# Altium schematic sheet clever_watch.SchDoc: Clever watch
size A3; Date: 13/04/2022; CheckedBy: Karol Witusik; Author: Wiktor Lechowicz; DocumentNumber: 305113, 305087; Revision: 1.0; SheetNumber: 1; SheetTotal: 1
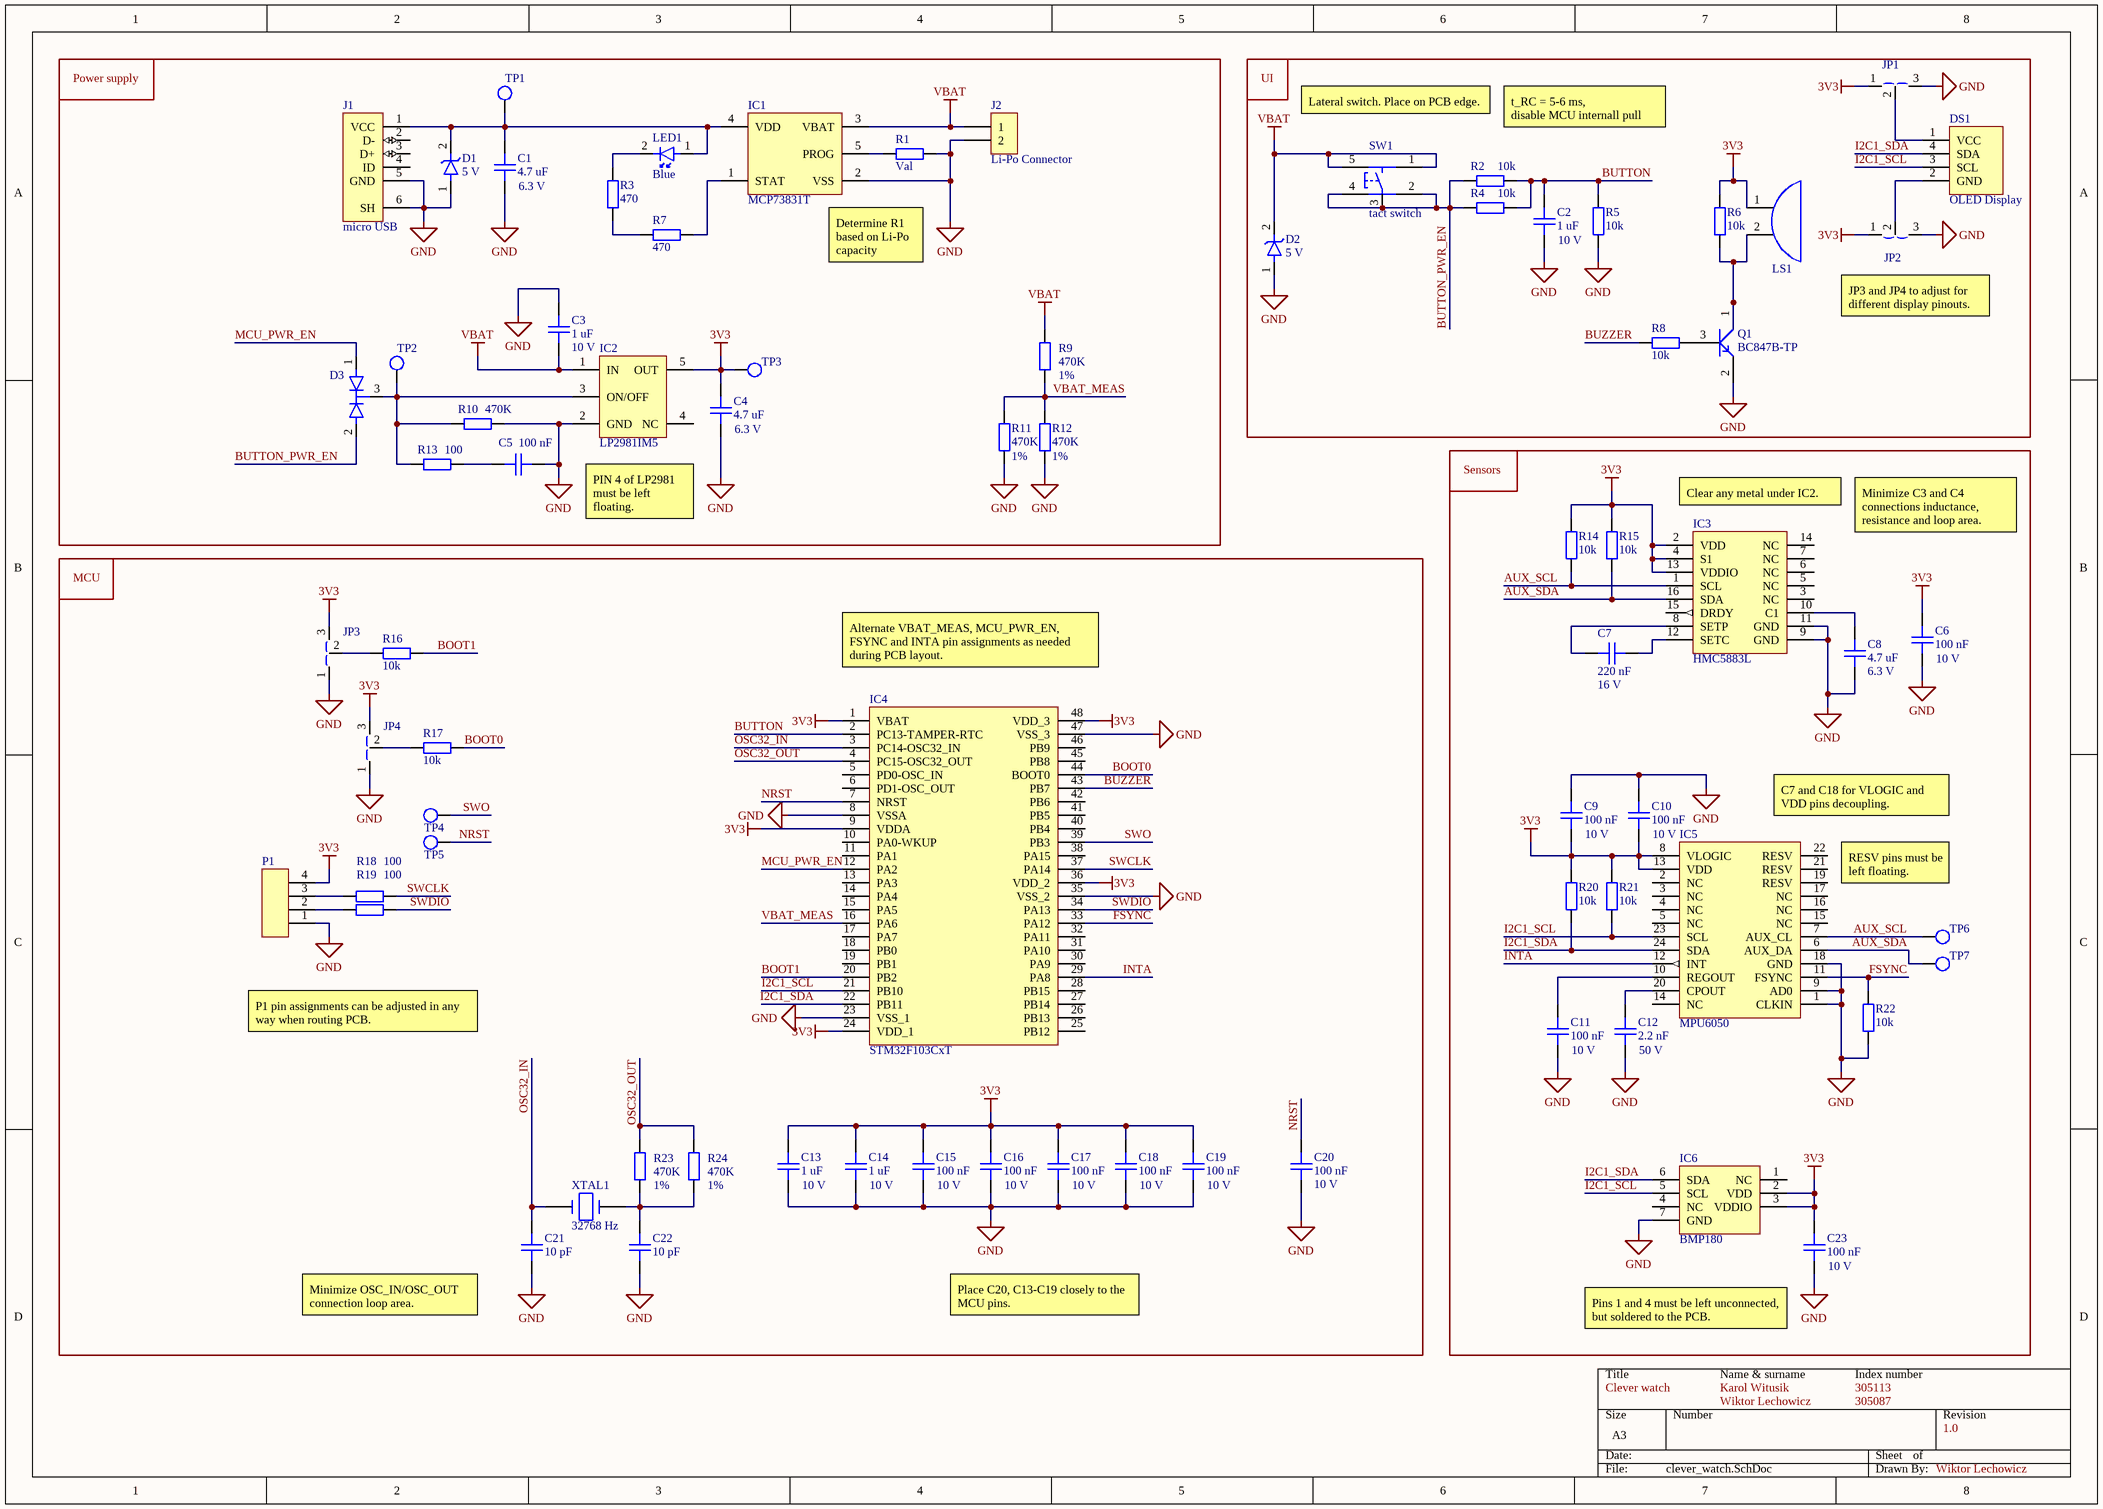
[diagram p0: clever_watch.SchDoc]

## Parts
C1  4.7 uF  Rated voltage: 6.3 V  [C0402]
C2  1 uF  Rated voltage: 10 V  [C0402]
C3  1 uF  Rated voltage: 10 V  [C0402]
C4  4.7 uF  Rated voltage: 6.3 V  [C0402]
C5  100 nF  [C0402]
C6  100 nF  Rated voltage: 10 V  [C0402]
C7  220 nF  Rated voltage: 16 V  [C0402]
C8  4.7 uF  Rated voltage: 6.3 V  [C0603]
C9  100 nF  Rated voltage: 10 V  [C0402]
C10  100 nF  Rated voltage: 10 V  [C0402]
C11  100 nF  Rated voltage: 10 V  [C0402]
C12  2.2 nF  Rated voltage: 50 V  [C0402]
C13  1 uF  Rated voltage: 10 V  [C0402]
C14  1 uF  Rated voltage: 10 V  [C0402]
C15  100 nF  Rated voltage: 10 V  [C0402]
C16  100 nF  Rated voltage: 10 V  [C0402]
C17  100 nF  Rated voltage: 10 V  [C0402]
C18  100 nF  Rated voltage: 10 V  [C0402]
C19  100 nF  Rated voltage: 10 V  [C0402]
C20  100 nF  Rated voltage: 10 V  [C0402]
C21  10 pF  [C0402]
C22  10 pF  [C0402]
C23  100 nF  Rated voltage: 10 V  [C0402]
D1  5 V  [SOD-323FL_477AB_ONS]
D2  5 V  [SOD-323FL_477AB_ONS]
D3  D_DOUBLE_CK2  [SOT65P210X110-3N]  (value not drawn)
DS1  OLED Display  [OLED SSD1306]
IC1  MCP73831T  [SOT-23-5_MC_MCH]
IC2  LP2981IM5  [SOT-23-5_MC_MCH]
IC3  HMC5883L  [LPCC16_HNW]
IC4  STM32F103CxT  [LQFP48-7x7mm]
IC5  MPU6050  [QFN24_4X4X0P9_IVS]
IC6  BMP180  [BMP180]
J1  micro USB  [AMPHENOL_10118194-0001LF]
J2  Li-Po Connector  [battery connector]  (no BOM)
JP1  JUMPER_3_PADS  [0402 jumper x3]  (value not drawn)
JP2  JUMPER_3_PADS  [0402 jumper x3]  (value not drawn)
JP3  JUMPER_3_PADS  [0402 jumper x3]  (value not drawn)
JP4  JUMPER_3_PADS  [0402 jumper x3]  (value not drawn)
LED1  Blue  [LED_0603]
LS1  BUZZER  [HDR_1X2_MALE]  (value not drawn)
P1  1x4 Header  [CONN_15-91-2045_MOL]  (value not drawn)
Q1  MPN: BC847B-TP  [SOT-23]  (hidden comment: Q_NPN_BEC)
R1  Val  [R0402]
R2  10k  [R0402]
R3  470  [R0402]
R4  10k  [R0402]
R5  10k  [R0402]
R6  10k  [R0402]
R7  470  [R0402]
R8  10k  [R0402]
R9  470K  Tolerance: 1%  [R0402]
R10  470K  [R0402]
R11  470K  Tolerance: 1%  [R0402]
R12  470K  Tolerance: 1%  [R0402]
R13  100  [R0402]
R14  10k  [R0402]
R15  10k  [R0402]
R16  10k  [R0402]
R17  10k  [R0402]
R18  100  [R0402]
R19  100  [R0402]
R20  10k  [R0402]
R21  10k  [R0402]
R22  10k  [R0402]
R23  470K  Tolerance: 1%  [R0402]
R24  470K  Tolerance: 1%  [R0402]
SW1  tact switch  [KMS221GLFS]
TP1  TEST_POINT  [Testpoint]  (value not drawn)  (no BOM)
TP2  TEST_POINT  [Testpoint]  (value not drawn)  (no BOM)
TP3  TEST_POINT  [Testpoint]  (value not drawn)  (no BOM)
TP4  TEST_POINT  [Testpoint]  (value not drawn)  (no BOM)
TP5  TEST_POINT  [Testpoint]  (value not drawn)  (no BOM)
TP6  TEST_POINT  [Testpoint]  (value not drawn)  (no BOM)
TP7  TEST_POINT  [Testpoint]  (value not drawn)  (no BOM)
XTAL1  32768 Hz  [ABS0732768KHZ7T]

## Blocks framed on the sheet
Power supply: C1 C3-C5 D1 D3 IC1 IC2 J1 J2 LED1 R1 R3 R7 R9-R13 TP1-TP3
UI: C2 D2 DS1 JP1 JP2 LS1 Q1 R2 R4-R6 R8 SW1
Sensors: C6-C12 C23 IC3 IC5 IC6 R14 R15 R20-R22 TP6 TP7
MCU: C13-C22 IC4 JP3 JP4 P1 R16-R19 R23 R24 TP4 TP5 XTAL1

## Nets
3V3: C4.2 C6.2 C9.1 C10.1 C13.2 C14.2 C15.2 C16.2 C17.2 C18.2 C19.2 C23.2 IC2.5(OUT) IC3.2(VDD) IC3.4(S1) IC3.13(VDDIO) IC4.1(VBAT) IC4.9(VDDA) IC4.24(VDD_1) IC4.36(VDD_2) IC4.48(VDD_3) IC5.8(VLOGIC) IC5.13(VDD) IC6.2(VDD) IC6.3(VDDIO) JP1.1 JP2.1 JP3.3 JP4.3 LS1.1 P1.4 R6.2 R14.2 R15.2 R20.2 R21.2 TP3.1
GND: C1.1 C2.1 C3.1 C4.1 C5.1 C6.1 C8.1 C9.2 C10.2 C11.1 C12.1 C13.1 C14.1 C15.1 C16.1 C17.1 C18.1 C19.1 C20.1 C21.2 C22.2 C23.1 D1.1(A) D2.1(A) IC1.2(VSS) IC2.2(GND) IC3.9(GND) IC3.11(GND) IC4.8(VSSA) IC4.23(VSS_1) IC4.35(VSS_2) IC4.47(VSS_3) IC5.1(CLKIN) IC5.9(AD0) IC5.18(GND) IC6.7(GND) J1.5(GND) J1.6(SH) J2.2 JP1.3 JP2.3 JP3.1 JP4.1 P1.1 Q1.2(E) R1.1 R5.2 R10.2 R11.1 R12.1 R22.1
VBAT: C3.2 D2.2(K) IC1.3(VBAT) IC2.1(IN) J2.1 R9.1 SW1.1 SW1.5
AUX_SCL: IC3.1(SCL) IC5.7(AUX_CL) R14.1 TP6.1
AUX_SDA: IC3.16(SDA) IC5.6(AUX_DA) R15.1 TP7.1
BOOT0: IC4.44(BOOT0) R17.2
BOOT1: IC4.20(PB2) R16.2
BUTTON: C2.2 IC4.2(PC13-TAMPER-RTC) R2.1 R4.1 R5.1
BUTTON_PWR_EN: D3.2(A2) R2.2 R4.2 SW1.2 SW1.3 SW1.4
BUZZER: IC4.43(PB7) R8.1
FSYNC: IC4.33(PA12) IC5.11(FSYNC) R22.2
I2C1_SCL: DS1.3(SCL) IC4.21(PB10) IC5.23(SCL) IC6.5(SCL) R21.1
I2C1_SDA: DS1.4(SDA) IC4.22(PB11) IC5.24(SDA) IC6.6(SDA) R20.1
INTA: IC4.29(PA8) IC5.12(INT)
MCU_PWR_EN: D3.1(A1) IC4.12(PA2)
NRST: C20.2 IC4.7(NRST) TP5.1
OSC32_IN: C21.1 IC4.3(PC14-OSC32_IN) XTAL1.1
OSC32_OUT: IC4.4(PC15-OSC32_OUT) R23.1 R24.1
SWCLK: IC4.37(PA14) R18.2
SWDIO: IC4.34(PA13) R19.2
SWO: IC4.39(PB3) TP4.1
VBAT_MEAS: IC4.16(PA6) R9.2 R11.2 R12.2
NetC1_2: C1.2 D1.2(K) IC1.4(VDD) J1.1(VCC) LED1.1(Anode) TP1.1
NetC5_2: C5.2 R13.2
NetC7_1: C7.1 IC3.12(SETC)
NetC7_2: C7.2 IC3.8(SETP)
NetC8_2: C8.2 IC3.10(C1)
NetC11_2: C11.2 IC5.10(REGOUT)
NetC12_2: C12.2 IC5.20(CPOUT)
NetC22_1: C22.1 R23.2 R24.2 XTAL1.2
NetD3_3: D3.3(K) IC2.3(ON/OFF) R10.1 R13.1 TP2.1
NetDS1_1: DS1.1(VCC) JP1.2
NetDS1_2: DS1.2(GND) JP2.2
NetIC1_1: IC1.1(STAT) R7.1
NetIC1_5: IC1.5(PROG) R1.2
NetJP3_2: JP3.2 R16.1
NetJP4_2: JP4.2 R17.1
NetLED1_2: LED1.2(Cathode) R3.2
NetLS1_2: LS1.2 Q1.1(C) R6.1
NetP1_2: P1.2 R19.1
NetP1_3: P1.3 R18.1
NetQ1_3: Q1.3(B) R8.2
NetR3_1: R3.1 R7.2

Not connected (* = marked no-connect by the designer): IC2 4(NC); IC3 3(NC) 5(NC) 6(NC) 7(NC) 14(NC) 15(DRDY); IC4 5(PD0-OSC_IN) 6(PD1-OSC_OUT) 10(PA0-WKUP) 11(PA1) 13(PA3) 14(PA4) 15(PA5) 17(PA7) 18(PB0) 19(PB1) 25(PB12) 26(PB13) 27(PB14) 28(PB15) 30(PA9) 31(PA10) 32(PA11) 38(PA15) 40(PB4) 41(PB5) 42(PB6) 45(PB8) 46(PB9); IC5 2(NC) 3(NC) 4(NC) 5(NC) 14(NC) 15(NC) 16(NC) 17(NC) 19(RESV) 21(RESV) 22(RESV); IC6 1(NC) 4(NC); J1 2(D-) 3(D+) 4(ID)

## Notes on the sheet
- Lateral switch. Place on PCB edge.
- t_RC = 5-6 ms,
  disable MCU internall pull
- (near IC1) Determine R1 based on Li-Po capacity
- (near JP2) JP3 and JP4 to adjust for different display pinouts.
- PIN 4 of LP2981 must be left floating.
- (near IC3) Clear any metal under IC2.
- Minimize C3 and C4 connections inductance, resistance and loop area.
- Alternate VBAT_MEAS, MCU_PWR_EN, FSYNC and INTA pin assignments as needed during PCB layout.
- (near IC5) C7 and C18 for VLOGIC and VDD pins decoupling.
- RESV pins must be left floating.
- P1 pin assignments can be adjusted in any way when routing PCB.
- Minimize OSC_IN/OSC_OUT connection loop area.
- Place C20, C13-C19 closely to the MCU pins.
- (near C23) Pins 1 and 4 must be left unconnected, but soldered to the PCB.
- Name & surname
- Karol Witusik
- Index number
- 305113
- Wiktor Lechowicz
- 305087

## Library data of the parts
C1 C4 C8 = C: MPN: GRM155R60J475ME87D; ComponentLink1Description: Link; ComponentLink1URL: https://www.tme.eu/en/details/grm155r60j475me87d/0402-mlcc-smd-capacitors/murata/
C2 C3 C13 C14 = C: MPN: GRM155R61A105KE15J; ComponentLink1Description: Link; ComponentLink1URL: https://www.tme.eu/en/details/grm155r61a105ke15j/0402-mlcc-smd-capacitors/murata/
C5 = C: MPN: CL05A104KP5NNNC; Rated voltage: 10 V; ComponentLink1Description: Link; ComponentLink1URL: https://www.tme.eu/en/details/cl05a104kp5nnnc/0402-mlcc-smd-capacitors/samsung/
C6 C9-C11 C15-C20 C23 = C: MPN: CL05A104KP5NNNC; ComponentLink1Description: Link; ComponentLink1URL: https://www.tme.eu/en/details/cl05a104kp5nnnc/0402-mlcc-smd-capacitors/samsung/
C7 = C: MPN: CL05B224KO5NNNC; ComponentLink1Description: Link; ComponentLink1URL: https://www.tme.eu/pl/details/cl05b224ko5nnnc/kondensatory-mlcc-smd-0402/samsung/
C12 = C: MPN: CC0402KRX7R9BB222; ComponentLink1Description: Link; ComponentLink1URL: https://www.tme.eu/pl/details/cc0402krx7r9bb222/kondensatory-mlcc-smd-0402/yageo/
C21 C22 = C: MPN: CC0402JRNPO9BN100; Rated voltage: 50 V; ComponentLink1Description: Link; ComponentLink1URL: https://www.tme.eu/pl/details/cc0402jrnpo9100/kondensatory-mlcc-smd-0402/yageo/cc0402jrnpo9bn100/
D1 D2 = TVS_DIODE: MPN: ESD3Z5V0; ComponentLink1Description: Link; ComponentLink1URL: https://www.tme.eu/pl/details/esd3z5v0-dio/diody-transil-smd-jednokierunkowe/diotec-semiconductor/esd3z5v0/
D3 = D_DOUBLE_CK2: MPN: 1PS70SB85.115; ComponentLink1Description: Link; ComponentLink1URL: https://www.tme.eu/en/details/1ps70sb85.115/smd-schottky-diodes/nexperia/
DS1 = OLED: MPN: OLED-SSD1306; ComponentLink1Description: Link; ComponentLink1URL: https://cdn-shop.adafruit.com/datasheets/SSD1306.pdf
IC1 = MCP73831T-xxxx/OT: MPN: MCP73831T-2ACI/OT; ComponentLink1Description: Link; ComponentLink1URL: https://www.tme.eu/en/details/mcp73831t-2aci_ot/battery-and-battery-cells-controllers/microchip-technology/
IC2 = LP2981IM5: MPN: LP2981IM5-3.3/NOPB; ComponentLink1Description: Link; ComponentLink1URL: https://www.tme.eu/en/details/lp2981im5-3.3_nopb/ldo-unregulated-voltage-regulators/texas-instruments/
IC4 = STM32F103CxT: MPN: STM32F103C8T6; ComponentLink1Description: Link; ComponentLink1URL: https://www.tme.eu/en/details/stm32f103c8t6/st-microcontrollers/stmicroelectronics/
J1 = USB_MICRO: MPN: 10118194-0001LF; ComponentLink1Description: Link; ComponentLink1URL: https://www.tme.eu/pl/details/10118194-0001lf/zlacza-usb-i-ieee1394/amphenol-communications-solutions/
J2 = 1x2_CONNECTOR
LED1 = LED: MPN: RF-BUB190TS-CA; ComponentLink1Description: Link; ComponentLink1URL: https://www.tme.eu/en/details/rf-bub190ts-ca/smd-colour-leds/refond/
LS1 = BUZZER: MPN: LD-EDPE-1209; ComponentLink1Description: Link; ComponentLink1URL: https://www.tme.eu/pl/details/ld-edpe-1209/sygnalizatory-piezoelekt-bez-generatora/loudity/
P1 = 1x4_HEADER: MPN: ZL315-4SGH; ComponentLink1Description: Link; ComponentLink1URL: https://www.tme.eu/pl/details/zl315-4sgh/listwy-i-gniazda-kolkowe/ninigi/
R1 R13 = R: ComponentLink1Description: Link; ComponentLink1URL: *; MPN: *
R2 R4-R6 R8 R14-R17 R20-R22 = R: MPN: RC0402FR-0710KL; Tolerance: 1%; ComponentLink1Description: Link; ComponentLink1URL: https://www.tme.eu/pl/details/rc0402fr-0710k/rezystory-smd-0402/yageo/rc0402fr-0710kl/
R3 R7 = R: MPN: RC0402FR-07470R; ComponentLink1Description: Link; ComponentLink1URL: https://www.tme.eu/en/details/rc0402fr-07470r/0402-smd-resistors/yageo/
R9 R11 R12 R23 R24 = R: MPN: AC0402FR-07470KL; ComponentLink1Description: Link
  R9 R23 R24: ComponentLink1URL: https://www.tme.eu/en/details/ac0402fr-07470kl/0402-smd-resistors/yageo/
  R11 R12: ComponentLink1URL: *
R10 = R: MPN: AC0402FR-07470KL; Tolerance: 1%; ComponentLink1Description: Link; ComponentLink1URL: https://www.tme.eu/en/details/ac0402fr-07470kl/0402-smd-resistors/yageo/
R18 R19 = R: MPN: RC0402FR-07100RL; Tolerance: 1%; ComponentLink1Description: Link; ComponentLink1URL: https://www.tme.eu/pl/details/rc0402fr-07100r/rezystory-smd-0402/yageo/rc0402fr-07100rl/
SW1 = TACT-SW: MPN: KMS221G LFS; ComponentLink1Description: Link; ComponentLink1URL: https://www.tme.eu/pl/details/kms221glfs/mikroprzelaczniki-tact/c-k/kms221g-lfs/
XTAL1 = CRYSTAL_OSC_2PINS: MPN: ABS07-32.768KHZ-7-T; ComponentLink1Description: Link; ComponentLink1URL: https://www.tme.eu/pl/details/abs07-32.768khz-7/rezonatory-kwarcowe-smd/abracon/abs07-32-768khz-7-t/
IC3 = HMC5883L: ComponentLink1Description: Link; ComponentLink1URL: https://cdn-shop.adafruit.com/datasheets/HMC5883L_3-Axis_Digital_Compass_IC.pdf; MPN: HMC5883L
IC5 = MPU6050: MPN: MPU6050; ComponentLink1Description: Link; ComponentLink1URL: https://product.tdk.com/system/files/dam/doc/product/sensor/mortion-inertial/imu/data_sheet/mpu-6000-datasheet1.pdf
IC6 = BMP180: MPN: BMP180; ComponentLink1Description: Link; ComponentLink1URL: https://cdn-shop.adafruit.com/datasheets/BST-BMP180-DS000-09.pdf
Q1 = Q_NPN_BEC: ComponentLink1Description: Link; ComponentLink1URL: https://www.tme.eu/pl/details/bc847b-tp/tranzystory-npn-smd/micro-commercial-components/